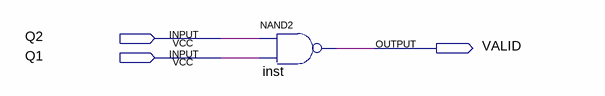
[diagram p0: schematic sheet]
// Quartus schematic CHECK.bdf as structural Verilog: 1 symbols, 3 pins
module CHECK (
  input  Q2,
  input  Q1,
  output VALID
);

  nand inst (VALID, Q2, Q1);
endmodule
